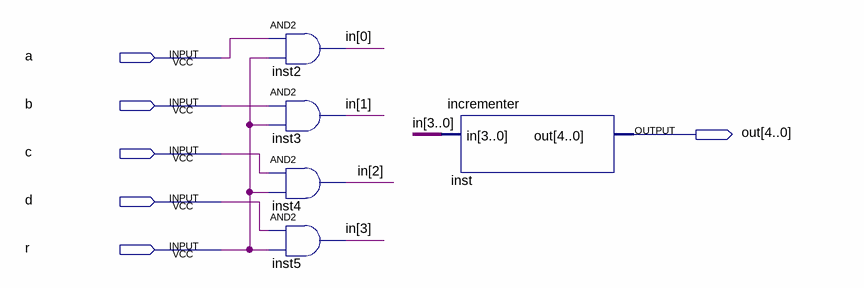
[diagram p0: schematic sheet]
// Quartus schematic tutorial.bdf as structural Verilog: 5 symbols, 6 pins
module tutorial (
  input  a,
  input  b,
  input  c,
  input  d,
  input  r,
  output [4:0] out
);

  wire [3:0] in;

  and inst2 (in[0], a, r);
  and inst3 (in[1], b, r);
  and inst4 (in[2], c, r);
  and inst5 (in[3], d, r);
  incrementer inst (.in(in), .out(out));
endmodule
